# Altium schematic sheet Main.SchDoc
size A; SheetNumber: 3; SheetTotal: 3
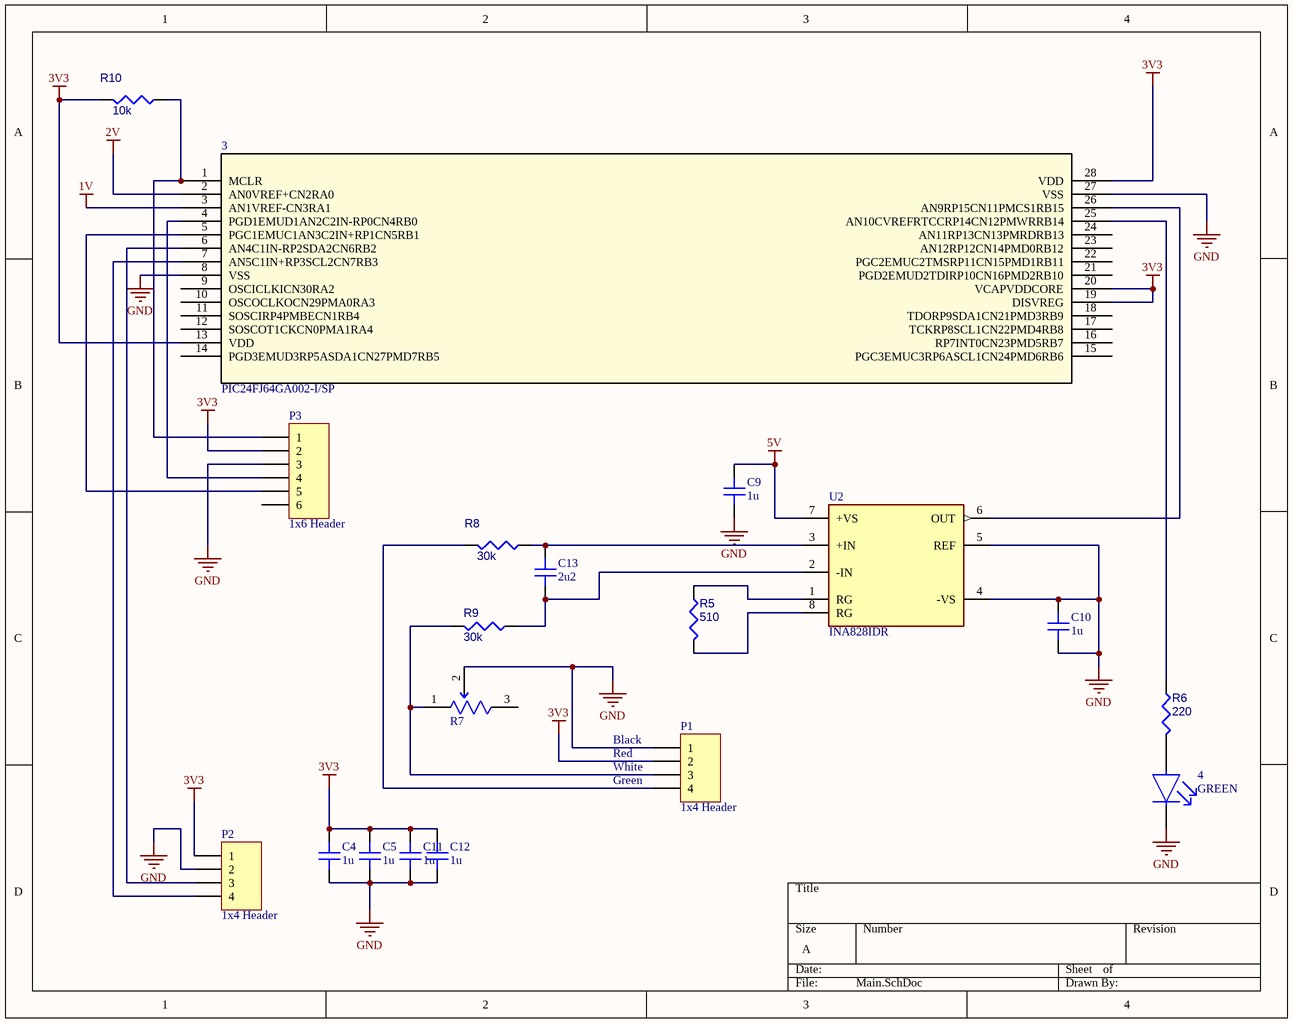
[diagram p0: Main.SchDoc]

## Parts
3  PIC24FJ64GA002-I/SP  [DIP787W46P254L3467H508Q28]
4  GREEN  [FP-ASMT-RF45-AN002-MFG]
C4  value 1u  [CAP 0603_1608]
C5  value 1u  [CAP 0603_1608]
C9  value 1u  [CAP 0603_1608]
C10  value 1u  [CAP 0603_1608]
C11  value 1u  [CAP 0603_1608]
C12  value 1u  [CAP 0603_1608]
C13  value 2u2  [CAP 0603_1608]
P1  1x4 Header  [1x4 Header]
P2  1x4 Header  [1x4 Header]
P3  1x6 Header  [1x6 Header]
R5  510  [RESC1608X55X25ML10T15]
R6  220  [RESC1608X55X25ML10T15]
R7  PV36W501C01B00  [FP-PV36W-MFG]  (value not drawn)
R8  30k  [RESC1608X55X25ML10T15]
R9  30k  [RESC1608X55X25ML10T15]
R10  10k  [RESC1608X55X25ML10T15]
U2  INA828IDR  [FP-D0008A-IPC_B]

## Nets
1V: 3.3(AN1VREF-CN3RA1)
2V: 3.2(AN0VREF+CN2RA0)
3V3: 3.13(VDD) 3.19(DISVREG) 3.20(VCAPVDDCORE) 3.28(VDD) C4.2 C5.2 C11.2 C12.2 P1.2 P2.1 P3.2 R10.2
5V: C9.2 U2.7(+VS)
GND: 3.8(VSS) 3.27(VSS) 4.1(C) C4.1 C5.1 C9.1 C10.1 C10.2 C11.1 C12.1 P1.1 P2.2 P3.3 R7.2 U2.4(-VS) U2.5(REF)
Net3_1: 3.1(MCLR) P3.1 R10.1
Net3_4: 3.4(PGD1EMUD1AN2C2IN-RP0CN4RB0) P3.4
Net3_5: 3.5(PGC1EMUC1AN3C2IN+RP1CN5RB1) P3.5
Net3_6: 3.6(AN4C1IN-RP2SDA2CN6RB2) P2.3
Net3_7: 3.7(AN5C1IN+RP3SCL2CN7RB3) P2.4
Net3_25: 3.25(AN10CVREFRTCCRP14CN12PMWRRB14) R6.1
Net3_26: 3.26(AN9RP15CN11PMCS1RB15) U2.6(OUT)
Net4_2: 4.2(A) R6.2
NetC13_1: C13.1 R9.1 U2.2(-IN)
NetC13_2: C13.2 R8.1 U2.3(+IN)
NetP1_3: P1.3 R7.1 R9.2
NetP1_4: P1.4 R8.2
NetR5_1: R5.1 U2.1(RG)
NetR5_2: R5.2 U2.8(RG)

Not connected (* = marked no-connect by the designer): 3 9(OSCICLKICN30RA2) 10(OSCOCLKOCN29PMA0RA3) 11(SOSCIRP4PMBECN1RB4) 12(SOSCOT1CKCN0PMA1RA4) 14(PGD3EMUD3RP5ASDA1CN27PMD7RB5) 15(PGC3EMUC3RP6ASCL1CN24PMD6RB6) 16(RP7INT0CN23PMD5RB7) 17(TCKRP8SCL1CN22PMD4RB8) 18(TDORP9SDA1CN21PMD3RB9) 21(PGD2EMUD2TDIRP10CN16PMD2RB10) 22(PGC2EMUC2TMSRP11CN15PMD1RB11) 23(AN12RP12CN14PMD0RB12) 24(AN11RP13CN13PMRDRB13); P3 6; R7 3

## Notes on the sheet
- (near P1) Black
- (near P1) Red
- (near P1) White
- (near P1) Green

## Library data of the parts
3 = CMP-031-00017-2: PIC PICÂ® 24F Microcontroller IC 16-Bit 32MHz 64KB _22K x 24_ FLASH 28-SPDIP; MF: Microchip; Availability: Unavailable; Design Item ID: PIC24FJ64GA002-I/SP; Value: *; Pins: 28; SnapEDA_Link: https://www.snapeda.com/parts/PIC24FJ64GA002-I/SP/Microchip/view-part/262458/?ref=snap; Case/Package: SPDIP-28 Microchip; Source: SnapEDAsch.SchLib; MP: PIC24FJ64GA002-I/SP; Price: None; Component Type: Standard
4 = CMP-2000-05796-2: ASMT-RF45-AN002 LED YLW/GREEN DIFFUSED 0603 SMD; Manufacturer: Broadcom; Viewing Angle: 145°; Reverse Voltage: 5V; Luminous Intensity: 60mcd; Forward Voltage: 2V; Wavelength: 573nm; Forward Current: 20mA; Led Orientation: Top View; Max Junction Temp: +110°C; Peak Emmision Wavelength: 574nm; Power Dissipation: 48mW; RoHS: TRUE; Category: Diode; Height: 0.55mm; Package: ASMT-RF45-AN002; Device Class L1: Optoelectronics; Temperature: -40°C to +100°C; Colour: Yellow Green; ComponentLink2URL: https://docs.broadcom.com/docs/AV02-0378EN; Mouser Description: LED; SMD; 0603; yellow green; 28-60mcd; 1.6x0.8x0.45mm; 145°; 20mA; Temperature Range High: +100°C; Temperature Range Low: -40°C; Octopart: https://octopart.com/asmt-rf45-an002-broadcom-71127304; Lead Free: Yes; ComponentLink2Description: Datasheet; Device Class L2: LEDs; Manufacturer Part Number: ASMT-RF45-AN002; Digikey Description: LED YLW/GREEN DIFFUSED 0603 SMD; Automotive: No; Device Class L3: unset
C4 C5 C9-C13 = CMP-184-001772-1: Part Number: ZRB18AR6YA475ME05L; manufacturer: Murata Electronics; Capacitance: 4.7 µF; Tolerance: ±20%; Voltage - Rated: 35V; Temperature Coefficient: X5R; ComponentLink1URL: https://search.murata.co.jp/Ceramy/image/img/A01X/G101/ENG/ZRB18AR6YA475ME05-01.pdf; Package / Case: 0603 (1608 Metric); series: ZRB; Mounting Type: Surface Mount, MLCC; ComponentLink2Description: DigiKey Link; partid: 9721; Device Package: 0603 (1608 Metric); Lifecycle Status: Active; packaging: TapeAndReel; Applications: Acoustic Noise Reduction; Part Status: Active; Thickness (Max): 0.047" (1.20mm); lastupdated: 9/19/2022 1:00:59 PM; Operating Temperature: -55°C ~ 85°C; ComponentLink2URL: https://www.digikey.com/en/products/detail/murata-electronics/ZRB18AR6YA475ME05L/7595507; price: 0.10; ComponentLink1Description: Datasheet; Minimum Order: 1; Size / Dimension: 0.063" L x 0.031" W (1.60mm x 0.80mm); Features: Interposer Termination
P1 P2 = CMP-006-000008-2: Male Header, Dupont, 1x4; Source: 1x4 Header.SchLib; Design Item ID: 1x4 Header
P3 = CMP-010-000000-2: Male Header, Dupont, 1x6; Source: 1x6 Header.SchLib; Design Item ID: 1x6 Header
R5 R6 R8-R10 = CMP-009-00014-4: Chip Resistor, +/-1%, 0.1 W, -55 to 155 degC, 0603 (1608 Metric); Value: 10 kOhms; Power: 100mW; Tolerance: 1%; Voltage Rating: 50V; Max Operating Temperature: 155°C; Pins: 2; RoHS Compliant: True; Case/Package: 0603; Min Operating Temperature: -55°C; Mounting Technology: SM
R7 = CMP-009-00201-1: Trimmer; RoHS Compliant: Yes
U2 = CMP-00026-1: Instrumentation Amplifier, 1 Func, 90uV Offset-Max, 2MHz Band Width, PDSO8